# Altium schematic sheet main.SchDoc
size A3; SheetNumber: 1; SheetTotal: 1
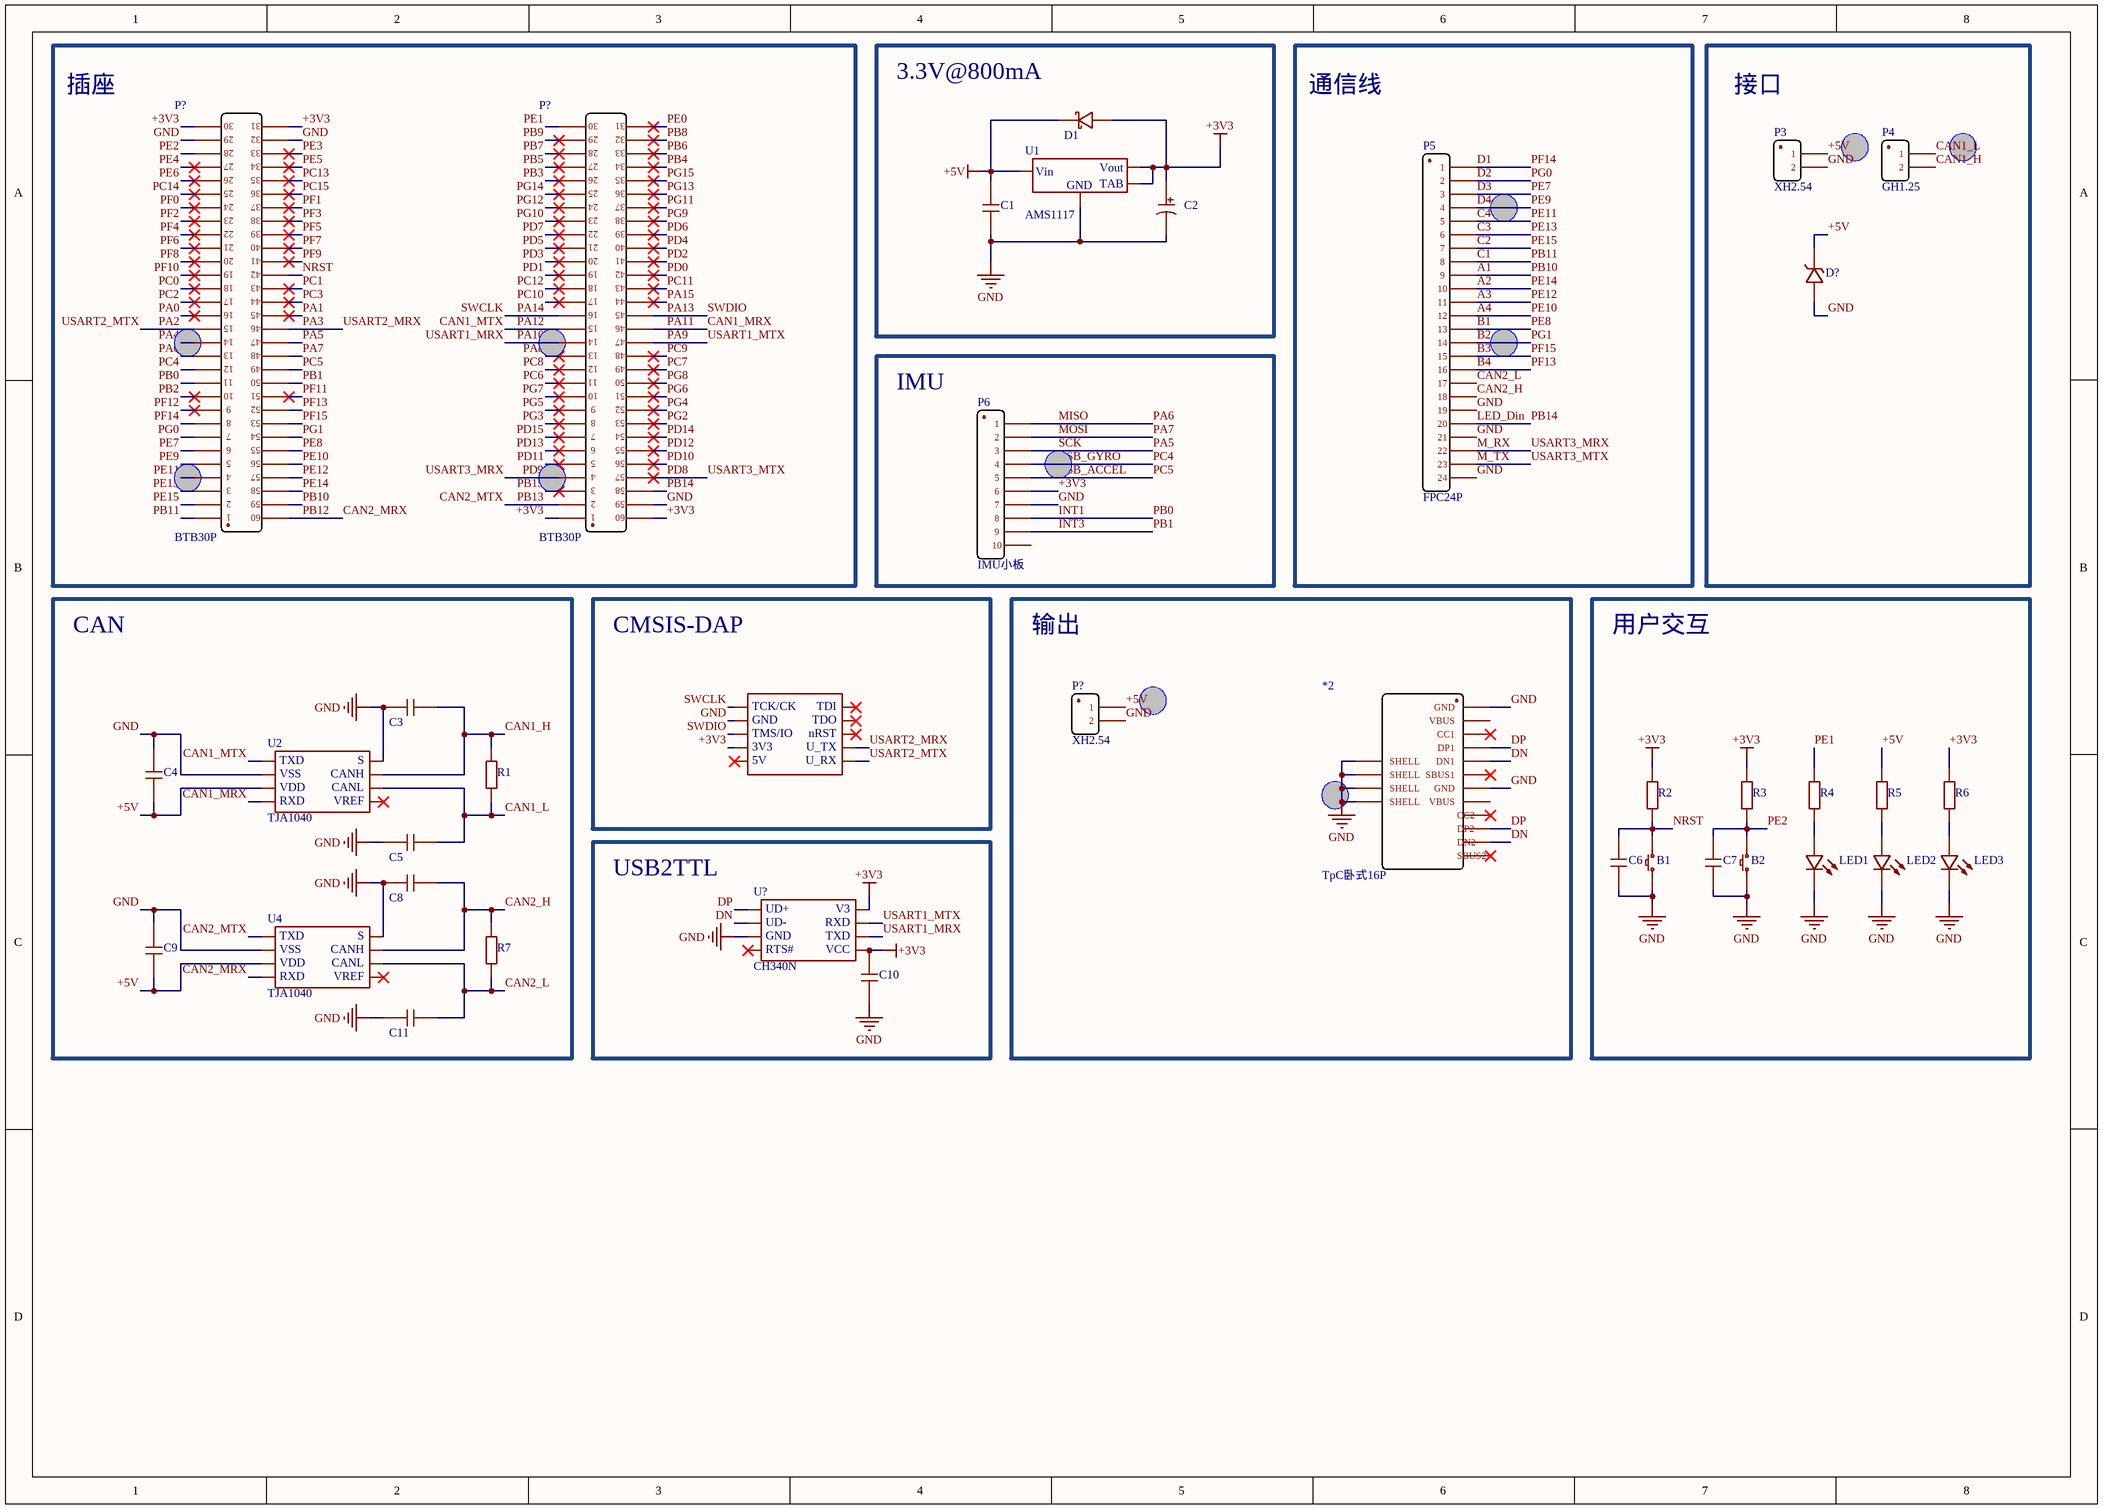
[diagram p0: main.SchDoc]

## Parts
(Parts that share a designator on the sheet are numbered #1, #2 ... from top to bottom, then left to right.)
1  CMSIS_DAP  [CMSIS_DAP_PW]  (value not drawn)
*2  TpC卧式16P  [USB-TypeC-PW-F-16P]
B1  按键  [*Button_3.5*3.55_W]  (value not drawn)
B2  按键  [*Button_3.5*3.55_W]  (value not drawn)
C1  10uF  [0603C]  (value not drawn)
C2  100uF  [3528B/1210]  (value not drawn)
C3  30pF  [0603C]  (value not drawn)
C4  0.1uF  [0603C]  (value not drawn)
C5  30pF  [0603C]  (value not drawn)
C6  0.1uF  [0603C]  (value not drawn)
C7  0.1uF  [0603C]  (value not drawn)
C8  30pF  [0603C]  (value not drawn)
C9  0.1uF  [0603C]  (value not drawn)
C10  0.1uF  [0603C]  (value not drawn)
C11  30pF  [0603C]  (value not drawn)
D1  SS34  [SMA]  (value not drawn)
D?  SMAJ5.0A  [SMA]  (value not drawn)
LED1  LED  [0603D]  (value not drawn)
LED2  LED  [0603D]  (value not drawn)
LED3  LED  [0603D]  (value not drawn)
P3  XH2.54  [XH2.54_AW_1*2]
P4  GH1.25  [GH1.25-PW-1*2]
P5  FPC24P  [FPC0.5-WT-24P]
P6  IMU小板  [FPC0.5-WT-10P]
P?#1  BTB30P  [BTB_M_30*2*0.8mm]
P?#2  BTB30P  [BTB_M_30*2*0.8mm]
P?#3  XH2.54  [XH2.54_AW_1*2]
R1  120  [0603R]  (value not drawn)
R2  10k  [0603R]  (value not drawn)
R3  10k  [0603R]  (value not drawn)
R4  10k  [0603R]  (value not drawn)
R5  10k  [0603R]  (value not drawn)
R6  10k  [0603R]  (value not drawn)
R7  120  [0603R]  (value not drawn)
U1  AMS1117  [SOT-223]
U2  TJA1040  [SOP-8]
U4  TJA1040  [SOP-8]
U?  CH340N  [SOP-8]

## Blocks framed on the sheet
插座: P?#1 P?#2
3.3V@800mA: C1 C2 D1 U1
通信线: P5
接口: D? P3 P4
IMU: P6
CAN: C3-C5 C8 C9 C11 R1 R7 U2 U4
CMSIS-DAP: 1
输出: *2 P?#3
用户交互: B1 B2 C6 C7 LED1-LED3 R2-R6
USB2TTL: C10 U?

## Nets
+3V3: 1.4 C2.1 C10.2 D1.1 P6.6 P?#1.30 P?#1.31 P?#2.1 P?#2.60 R2.2 R3.2 R6.2 U1.2 U1.4 U?.5 U?.8
+5V: C1.2 C4.1 C9.1 D1.2 D?.2 P3.1 P?#3.1 R5.2 U1.3 U2.3 U4.3
GND: 1.2 *2.13 *2.14 *2.15 *2.16 *2.A1B12 *2.B1A12 B1.1 B2.1 C1.1 C2.2 C3.1 C4.2 C5.1 C6.1 C7.1 C8.1 C9.2 C10.1 C11.1 D?.1 LED1.2 LED2.2 LED3.2 P3.2 P5.19 P5.21 P5.24 P6.7 P?#1.29 P?#1.32 P?#2.59 P?#3.2 U1.1 U2.2 U2.8 U4.2 U4.8 U?.3
A1: P5.9 P?#1.59  [also labelled PB10]
A2: P5.10 P?#1.58  [also labelled PE14]
A3: P5.11 P?#1.57  [also labelled PE12]
A4: P5.12 P?#1.56  [also labelled PE10]
B1: P5.13 P?#1.55  [also labelled PE8]
B2: P5.14 P?#1.54  [also labelled PG1]
B3: P5.15 P?#1.53  [also labelled PF15]
B4: P5.16 P?#1.52  [also labelled PF13]
C1: P5.8 P?#1.1  [also labelled PB11]
C2: P5.7 P?#1.2  [also labelled PE15]
C3: P5.6 P?#1.3  [also labelled PE13]
C4: P5.5 P?#1.4  [also labelled PE11]
CAN1_H: C3.2 P4.2 R1.2 U2.7
CAN1_L: C5.2 P4.1 R1.1 U2.6
CAN1_MRX: P?#2.46 U2.4  [also labelled PA11]
CAN1_MTX: P?#2.15 U2.1  [also labelled PA12]
CAN2_H: C8.2 P5.18 R7.2 U4.7
CAN2_L: C11.2 P5.17 R7.1 U4.6
CAN2_MRX: P?#1.60 U4.4  [also labelled PB12]
CAN2_MTX: P?#2.2 U4.1  [also labelled PB13]
CSB_ACCEL: P6.5 P?#1.49  [also labelled PC5]
CSB_GYRO: P6.4 P?#1.12  [also labelled PC4]
D1: P5.1 P?#1.8  [also labelled PF14]
D2: P5.2 P?#1.7  [also labelled PG0]
D3: P5.3 P?#1.6  [also labelled PE7]
D4: P5.4 P?#1.5  [also labelled PE9]
DN: *2.A7 *2.B7 U?.2
DP: *2.A6 *2.B6 U?.1
INT1: P6.8 P?#1.11  [also labelled PB0]
INT3: P6.9 P?#1.50  [also labelled PB1]
LED_Din: P5.20 P?#2.58  [also labelled PB14]
M_RX: P5.22 P?#2.4  [also labelled PD9, USART3_MRX]
M_TX: P5.23 P?#2.57  [also labelled PD8, USART3_MTX]
MISO: P6.1 P?#1.13  [also labelled PA6]
MOSI: P6.2 P?#1.48  [also labelled PA7]
NRST: B1.2 C6.2 P?#1.42 R2.1
PA0: P?#1.16
PA1: P?#1.45
PA2: 1.6 P?#1.15  [also labelled USART2_MTX]
PA3: 1.7 P?#1.46  [also labelled USART2_MRX]
PA4: P?#1.14
PA5: P6.3 P?#1.47  [also labelled SCK]
PA8: P?#2.13
PA9: P?#2.47 U?.7  [also labelled USART1_MTX]
PA10: P?#2.14 U?.6  [also labelled USART1_MRX]
PA13: 1.3 P?#2.45  [also labelled SWDIO]
PA14: 1.1 P?#2.16  [also labelled SWCLK]
PA15: P?#2.44
PB2: P?#1.10
PB3: P?#2.26
PB4: P?#2.34
PB5: P?#2.27
PB6: P?#2.33
PB7: P?#2.28
PB8: P?#2.32
PB9: P?#2.29
PB15: P?#2.3
PC0: P?#1.18
PC1: P?#1.43
PC2: P?#1.17
PC3: P?#1.44
PC6: P?#2.11
PC7: P?#2.49
PC8: P?#2.12
PC9: P?#2.48
PC10: P?#2.17
PC11: P?#2.43
PC12: P?#2.18
PC13: P?#1.35
PC14: P?#1.25
PC15: P?#1.36
PD0: P?#2.42
PD1: P?#2.19
PD2: P?#2.41
PD3: P?#2.20
PD4: P?#2.40
PD5: P?#2.21
PD6: P?#2.39
PD7: P?#2.22
PD10: P?#2.56
PD11: P?#2.5
PD12: P?#2.55
PD13: P?#2.6
PD14: P?#2.54
PD15: P?#2.7
PE0: P?#2.31
PE1: P?#2.30 R4.2
PE2: B2.2 C7.2 P?#1.28 R3.1
PE3: P?#1.33
PE4: P?#1.27
PE5: P?#1.34
PE6: P?#1.26
PF0: P?#1.24
PF1: P?#1.37
PF2: P?#1.23
PF3: P?#1.38
PF4: P?#1.22
PF5: P?#1.39
PF6: P?#1.21
PF7: P?#1.40
PF8: P?#1.20
PF9: P?#1.41
PF10: P?#1.19
PF11: P?#1.51
PF12: P?#1.9
PG2: P?#2.53
PG3: P?#2.8
PG4: P?#2.52
PG5: P?#2.9
PG6: P?#2.51
PG7: P?#2.10
PG8: P?#2.50
PG9: P?#2.38
PG10: P?#2.23
PG11: P?#2.37
PG12: P?#2.24
PG13: P?#2.36
PG14: P?#2.25
PG15: P?#2.35
NetLED1_1: LED1.1 R4.1
NetLED2_1: LED2.1 R5.1
NetLED3_1: LED3.1 R6.1

Not connected (* = marked no-connect by the designer): 1 5* 8* 9* 10*; *2 A4B9(2) A5(3)* A8(6)* B4A9(8) B5(8)* B8(8)*; P6 10; U2 5*; U4 5*; U? 4*

## Notes on the sheet
- (in symbol CMSIS_DAP) TCK/CK; TDI; GND; TDO; TMS/IO; nRST; 3V3; U_TX; 5V; U_RX
- (in symbol 接口USB-C-16P) GND; VBUS; CC1; DP1; SHELL; DN1; SBUS1; CC2; DP2; DN2; SBUS2
- (in symbol 芯片/IC-CAN通信-TJA1040) TXD; S; VSS; CANH; VDD; CANL; RXD; VREF
- (in symbol 芯片/IC-USB转串口-CH340N) UD+; V3; UD-; RXD; GND; TXD; RTS#; VCC
- (in symbol 芯片/IC-线性稳压管-AMS1117) Vout; Vin; TAB; GND

## Library data of the parts
*2 = 接口USB-C-16P
B1 B2 = 按键_贴片
C1 C3-C11 = 电容_贴片
C2 = 电容_贴片钽
D1 = 二极管_肖特基
D? = 二极管_瞬态抑制
LED1-LED3 = 二极管_贴片发光
P3 P4 P?#3 = 接插件1*2
P5 = 接插件1*24
P6 = 接插件1*10
P?#1 P?#2 = 接插件2*30
R1-R7 = 电阻_贴片
U1 = 芯片/IC-线性稳压管-AMS1117
U2 U4 = 芯片/IC-CAN通信-TJA1040
U? = 芯片/IC-USB转串口-CH340N